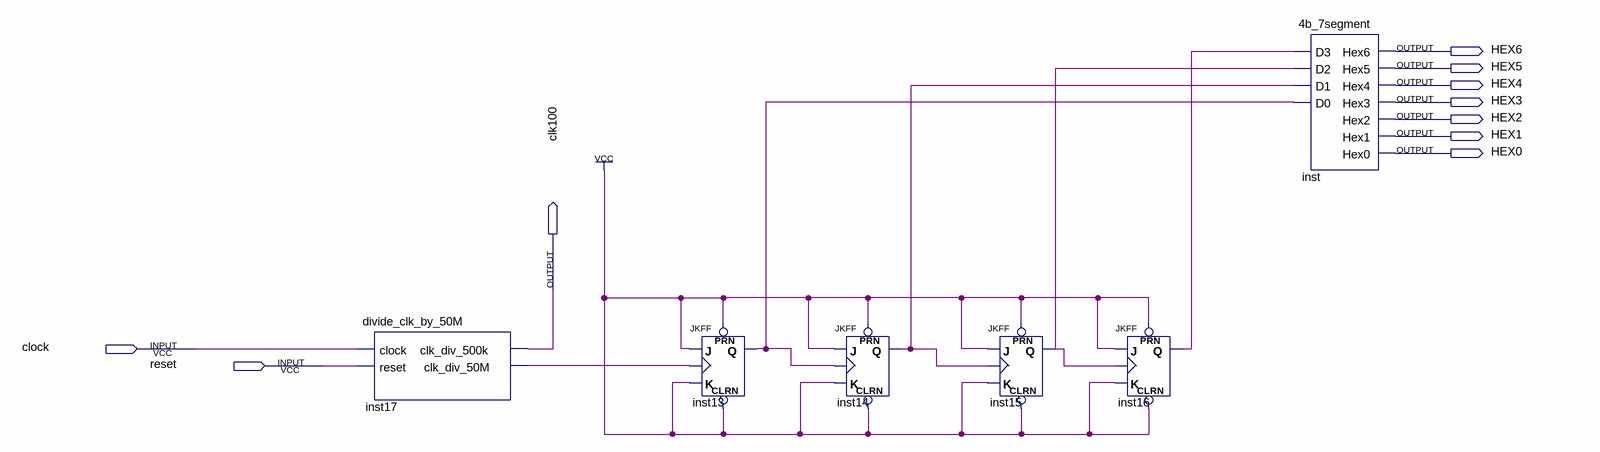
[diagram p0: schematic sheet]
// Quartus schematic pushbutton_counter.bdf as structural Verilog: 6 symbols, 10 pins
module pushbutton_counter (
  input  clock,
  input  reset,
  output HEX6,
  output HEX5,
  output HEX4,
  output HEX3,
  output HEX2,
  output HEX1,
  output HEX0,
  output clk100
);

  wire inst13_q, inst14_q, inst15_q, inst16_q, inst17_clk_div_50m;

  divide_clk_by_50M inst17 (.clock(clock), .reset(reset), .clk_div_500k(clk100), .clk_div_50M(inst17_clk_div_50m));
  JKFF inst13 (.PRN(1'b1), .CLRN(1'b1), .K(1'b1), .J(1'b1), .CLK(inst17_clk_div_50m), .Q(inst13_q));
  JKFF inst14 (.PRN(1'b1), .CLRN(1'b1), .K(1'b1), .J(1'b1), .CLK(inst13_q), .Q(inst14_q));
  JKFF inst15 (.PRN(1'b1), .CLRN(1'b1), .K(1'b1), .J(1'b1), .CLK(inst14_q), .Q(inst15_q));
  JKFF inst16 (.PRN(1'b1), .CLRN(1'b1), .K(1'b1), .J(1'b1), .CLK(inst15_q), .Q(inst16_q));
  \4b_7segment  inst (
    .D3(inst16_q), .D2(inst15_q), .D1(inst14_q), .D0(inst13_q), .Hex6(HEX6), .Hex5(HEX5), .Hex4(HEX4),
    .Hex3(HEX3), .Hex2(HEX2), .Hex1(HEX1), .Hex0(HEX0));
endmodule
